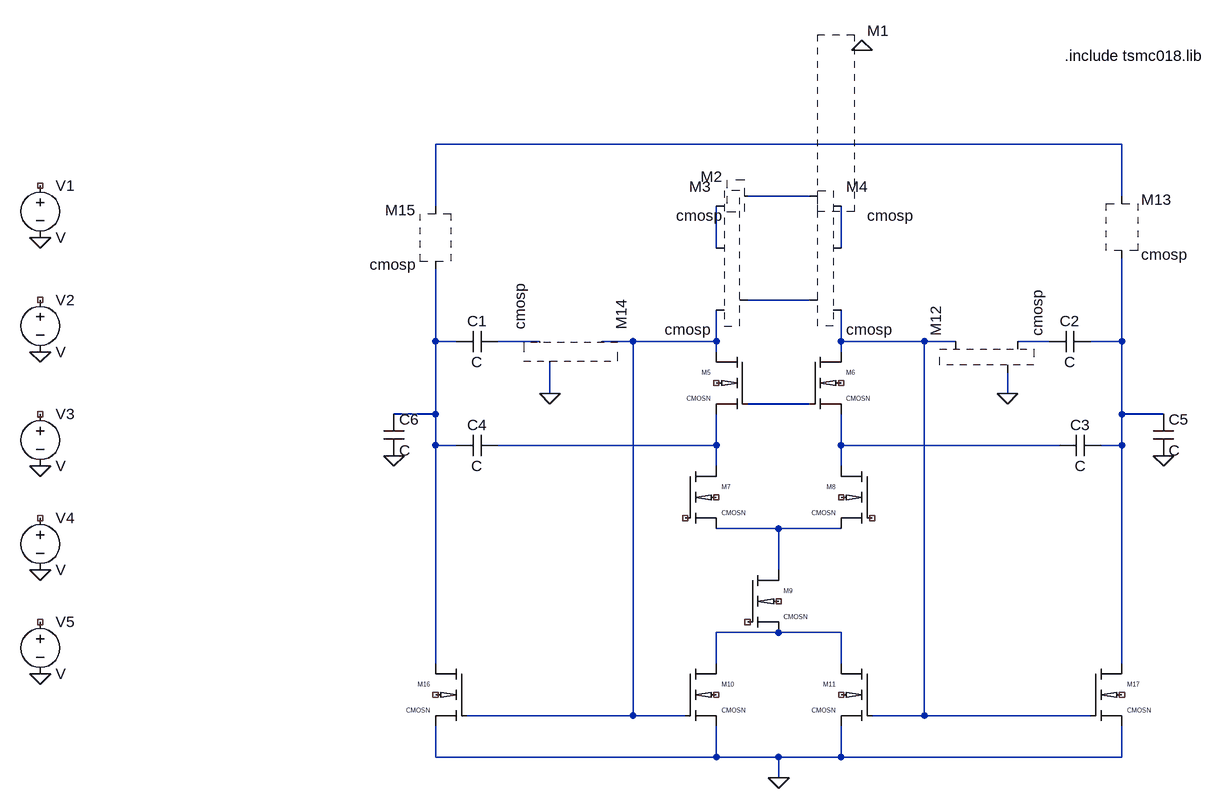
[diagram p0: schematic Draft1.asc]
Draft1.asc, the LTspice schematic file:
Version 4
SHEET 1 880 1136
WIRE -224 144 -656 144
WIRE -32 144 -224 144
WIRE 400 144 -32 144
WIRE -80 224 -176 224
WIRE 400 224 400 144
WIRE -656 240 -656 144
WIRE -224 304 -224 240
WIRE -32 304 -32 240
WIRE -80 384 -176 384
WIRE -656 448 -656 336
WIRE -624 448 -656 448
WIRE -496 448 -560 448
WIRE -352 448 -400 448
WIRE -224 448 -224 400
WIRE -224 448 -352 448
WIRE -32 448 -32 400
WIRE 96 448 -32 448
WIRE 144 448 96 448
WIRE 288 448 240 448
WIRE 400 448 400 320
WIRE 400 448 352 448
WIRE -224 464 -224 448
WIRE -32 464 -32 448
WIRE -480 496 -480 480
WIRE -480 528 -480 496
WIRE 224 528 224 496
WIRE -80 544 -176 544
WIRE -656 560 -656 448
WIRE -656 560 -720 560
WIRE 400 560 400 448
WIRE 464 560 400 560
WIRE -656 608 -656 560
WIRE -624 608 -656 608
WIRE -224 608 -224 560
WIRE -224 608 -560 608
WIRE -32 608 -32 560
WIRE 304 608 -32 608
WIRE 400 608 400 560
WIRE 400 608 368 608
WIRE -224 640 -224 608
WIRE -32 640 -32 608
WIRE -128 736 -224 736
WIRE -32 736 -128 736
WIRE -128 800 -128 736
WIRE -128 896 -224 896
WIRE -32 896 -128 896
WIRE -656 944 -656 608
WIRE -224 944 -224 896
WIRE -32 944 -32 896
WIRE 400 944 400 608
WIRE -352 1024 -352 448
WIRE -352 1024 -608 1024
WIRE -272 1024 -352 1024
WIRE 96 1024 96 448
WIRE 96 1024 16 1024
WIRE 352 1024 96 1024
WIRE -656 1088 -656 1040
WIRE -224 1088 -224 1040
WIRE -224 1088 -656 1088
WIRE -128 1088 -224 1088
WIRE -32 1088 -32 1040
WIRE -32 1088 -128 1088
WIRE 400 1088 400 1040
WIRE 400 1088 -32 1088
WIRE -128 1120 -128 1088
FLAG -128 1120 0
FLAG 464 624 0
FLAG -720 624 0
FLAG -480 528 0
FLAG 224 528 0
FLAG -1264 288 0
FLAG -1264 464 0
FLAG -1264 640 0
FLAG -1264 800 0
FLAG -1264 960 0
FLAG 0 0 0
SYMBOL cmosp -80 144 R0
SYMATTR InstName M1
SYMBOL cmosp -176 144 M0
SYMATTR InstName M2
SYMBOL cmosp -176 304 M0
SYMATTR InstName M3
SYMBOL cmosp -80 304 R0
SYMATTR InstName M4
SYMBOL cmosn -176 464 M0
SYMATTR InstName M5
SYMBOL cmosn -80 464 R0
SYMATTR InstName M6
SYMBOL cmosn -272 640 R0
SYMATTR InstName M7
SYMBOL cmosn 16 640 M0
SYMATTR InstName M8
SYMBOL cmosn -176 800 R0
SYMATTR InstName M9
SYMBOL cmosn -272 944 R0
SYMATTR InstName M10
SYMBOL cmosn 16 944 M0
SYMATTR InstName M11
SYMBOL cmosp 144 496 R270
SYMATTR InstName M12
SYMBOL cmosp 352 224 R0
SYMATTR InstName M13
SYMBOL cmosp -400 496 M270
SYMATTR InstName M14
SYMBOL cmosp -608 240 M0
SYMATTR InstName M15
SYMBOL cmosn -608 944 M0
SYMATTR InstName M16
SYMBOL cmosn 352 944 R0
SYMATTR InstName M17
SYMBOL cap -560 432 R90
WINDOW 0 0 32 VBottom 2
WINDOW 3 32 32 VTop 2
SYMATTR InstName C1
SYMBOL cap 352 432 R90
WINDOW 0 0 32 VBottom 2
WINDOW 3 32 32 VTop 2
SYMATTR InstName C2
SYMBOL cap 368 592 R90
WINDOW 0 0 32 VBottom 2
WINDOW 3 32 32 VTop 2
SYMATTR InstName C3
SYMBOL cap -560 592 R90
WINDOW 0 0 32 VBottom 2
WINDOW 3 32 32 VTop 2
SYMATTR InstName C4
SYMBOL cap 448 560 R0
SYMATTR InstName C5
SYMBOL cap -736 560 R0
SYMATTR InstName C6
SYMBOL voltage -1264 192 R0
SYMATTR InstName V1
SYMBOL voltage -1264 368 R0
SYMATTR InstName V2
SYMBOL voltage -1264 544 R0
SYMATTR InstName V3
SYMBOL voltage -1264 704 R0
SYMATTR InstName V4
SYMBOL voltage -1264 864 R0
SYMATTR InstName V5
TEXT 312 8 Left 2 !.include tsmc018.lib

The netlist it stands for:
* Draft1.asc
* M1: cmosp (symbol cmosp not available, pin order unknown); nets seen at it: 0, N002
* M2: cmosp (symbol cmosp not available, pin order unknown); nets seen at it: N002
* M3: cmosp (symbol cmosp not available, pin order unknown); nets seen at it: N003, N005, N008
* M4: cmosp (symbol cmosp not available, pin order unknown); nets seen at it: N004, N005, N009
M5 N008 N012 N013 NC_01 CMOSN
M6 N009 N012 N014 NC_02 CMOSN
M7 N013 NC_03 N015 NC_04 CMOSN
M8 N014 NC_05 N015 NC_06 CMOSN
M9 N015 NC_07 N016 NC_08 CMOSN
M10 N016 N008 0 NC_09 CMOSN
M11 N016 N009 0 NC_10 CMOSN
* M12: cmosp (symbol cmosp not available, pin order unknown); nets seen at it: 0, N009, N010
* M13: cmosp (symbol cmosp not available, pin order unknown); nets seen at it: N001, N011
* M14: cmosp (symbol cmosp not available, pin order unknown); nets seen at it: 0, N007, N008
* M15: cmosp (symbol cmosp not available, pin order unknown); nets seen at it: N001, N006
M16 N006 N008 0 NC_11 CMOSN
M17 N011 N009 0 NC_12 CMOSN
C1 N007 N006 C
C2 N011 N010 C
C3 N011 N014 C
C4 N013 N006 C
C5 N011 0 C
C6 N006 0 C
V1 NC_13 0 V
V2 NC_14 0 V
V3 NC_15 0 V
V4 NC_16 0 V
V5 NC_17 0 V
.model NMOS NMOS
.model PMOS PMOS
.lib standard.mos
.include tsmc018.lib
.lib tsmc018.lib
.backanno
.end